# Altium schematic sheet Ind_board.SchDoc: CV060 HVAC Controller
size A3; Author: PPavlov; DrawnBy: PPavlov; Engineer: PPavlov; Organization: Celse; DocumentNumber: 1; Revision: 1; SheetNumber: 1; SheetTotal: 3
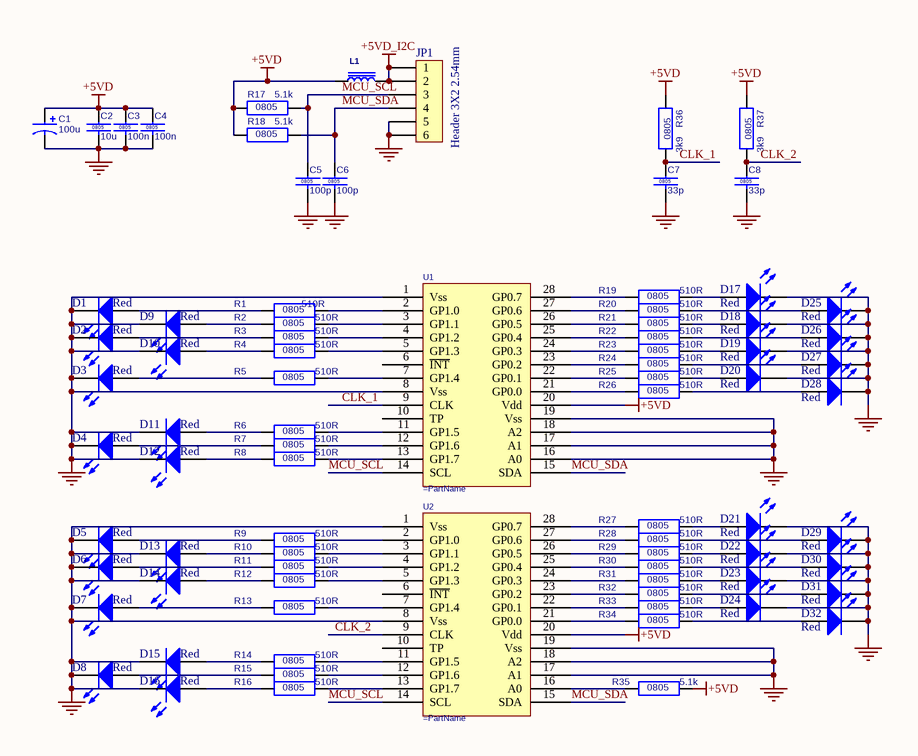
[diagram p0: Ind_board.SchDoc]

## Parts
C1  100u  [CEH12.5D10P5.0]
C2  Case: 0805  [RC0805]  (hidden comment: 10u)
C3  Case: 0805  [RC0805]  (hidden comment: 100n)
C4  Case: 0805  [RC0805]  (hidden comment: 100n)
C5  Case: 0805  [RC0805]  (hidden comment: 100p)
C6  Case: 0805  [RC0805]  (hidden comment: 100p)
C7  Case: 0805  [RC0805]  (hidden comment: 33p)
C8  Case: 0805  [RC0805]  (hidden comment: 33p)
D1  RED  [LED0805]
D2  RED  [LED0805]
D3  RED  [LED0805]
D4  RED  [LED0805]
D5  RED  [LED0805]
D6  RED  [LED0805]
D7  RED  [LED0805]
D8  RED  [LED0805]
D9  RED  [LED0805]
D10  RED  [LED0805]
D11  RED  [LED0805]
D12  RED  [LED0805]
D13  RED  [LED0805]
D14  RED  [LED0805]
D15  RED  [LED0805]
D16  RED  [LED0805]
D17  RED  [LED0805]
D18  RED  [LED0805]
D19  RED  [LED0805]
D20  RED  [LED0805]
D21  RED  [LED0805]
D22  RED  [LED0805]
D23  RED  [LED0805]
D24  RED  [LED0805]
D25  RED  [LED0805]
D26  RED  [LED0805]
D27  RED  [LED0805]
D28  RED  [LED0805]
D29  RED  [LED0805]
D30  RED  [LED0805]
D31  RED  [LED0805]
D32  RED  [LED0805]
JP1  Header 3X2 2.54mm  [Pins2x3_2.54mm]
L1  BLM31PG601SN1  [RC1206]  (value not drawn)
R1  Case: 0805  [RC0805]  (hidden comment: 510R)
R2  Case: 0805  [RC0805]  (hidden comment: 510R)
R3  Case: 0805  [RC0805]  (hidden comment: 510R)
R4  Case: 0805  [RC0805]  (hidden comment: 510R)
R5  Case: 0805  [RC0805]  (hidden comment: 510R)
R6  Case: 0805  [RC0805]  (hidden comment: 510R)
R7  Case: 0805  [RC0805]  (hidden comment: 510R)
R8  Case: 0805  [RC0805]  (hidden comment: 510R)
R9  Case: 0805  [RC0805]  (hidden comment: 510R)
R10  Case: 0805  [RC0805]  (hidden comment: 510R)
R11  Case: 0805  [RC0805]  (hidden comment: 510R)
R12  Case: 0805  [RC0805]  (hidden comment: 510R)
R13  Case: 0805  [RC0805]  (hidden comment: 510R)
R14  Case: 0805  [RC0805]  (hidden comment: 510R)
R15  Case: 0805  [RC0805]  (hidden comment: 510R)
R16  Case: 0805  [RC0805]  (hidden comment: 510R)
R17  Case: 0805  [RC0805]  (hidden comment: 5.1k)
R18  Case: 0805  [RC0805]  (hidden comment: 5.1k)
R19  Case: 0805  [RC0805]  (hidden comment: 510R)
R20  Case: 0805  [RC0805]  (hidden comment: 510R)
R21  Case: 0805  [RC0805]  (hidden comment: 510R)
R22  Case: 0805  [RC0805]  (hidden comment: 510R)
R23  Case: 0805  [RC0805]  (hidden comment: 510R)
R24  Case: 0805  [RC0805]  (hidden comment: 510R)
R25  Case: 0805  [RC0805]  (hidden comment: 510R)
R26  Case: 0805  [RC0805]  (hidden comment: 510R)
R27  Case: 0805  [RC0805]  (hidden comment: 510R)
R28  Case: 0805  [RC0805]  (hidden comment: 510R)
R29  Case: 0805  [RC0805]  (hidden comment: 510R)
R30  Case: 0805  [RC0805]  (hidden comment: 510R)
R31  Case: 0805  [RC0805]  (hidden comment: 510R)
R32  Case: 0805  [RC0805]  (hidden comment: 510R)
R33  Case: 0805  [RC0805]  (hidden comment: 510R)
R34  Case: 0805  [RC0805]  (hidden comment: 510R)
R35  Case: 0805  [RC0805]  (hidden comment: 5.1k)
R36  Case: 0805  [RC0805]  (hidden comment: 3k9)
R37  Case: 0805  [RC0805]  (hidden comment: 3k9)
U1  (no value)  [SO-28]
U2  (no value)  [SO-28]

## Nets
+5VD: C1.1 C2.1 C3.1 C4.1 L1.1 R17.1 R18.1 R35.2 R36.1 R37.1 U1.20(Vdd) U2.20(Vdd)
+5VD_I2C: JP1.1 JP1.2 L1.2
DGND: C1.2 C2.2 C3.2 C4.2 C5.2 C6.2 C7.2 C8.2 D1.1(K) D2.1(K) D3.1(K) D4.1(K) D5.1(K) D6.1(K) D7.1(K) D8.1(K) D9.1(K) D10.1(K) D11.1(K) D12.1(K) D13.1(K) D14.1(K) D15.1(K) D16.1(K) D17.1(K) D18.1(K) D19.1(K) D20.1(K) D21.1(K) D22.1(K) D23.1(K) D24.1(K) D25.1(K) D26.1(K) D27.1(K) D28.1(K) D29.1(K) D30.1(K) D31.1(K) D32.1(K) JP1.5 JP1.6 U1.1(Vss) U1.8(Vss) U1.16(A0) U1.17(A1) U1.18(A2) U1.19(Vss) U2.1(Vss) U2.8(Vss) U2.17(A1) U2.18(A2) U2.19(Vss)
CLK_1: C7.1 R36.2 U1.9(CLK)
CLK_2: C8.1 R37.2 U2.9(CLK)
MCU_SCL: C5.1 JP1.3 R17.2 U1.14(SCL) U2.14(SCL)
MCU_SDA: C6.1 JP1.4 R18.2 U1.15(SDA) U2.15(SDA)
NetD1_2: D1.2(A) R1.1
NetD2_2: D2.2(A) R3.1
NetD3_2: D3.2(A) R5.1
NetD4_2: D4.2(A) R7.1
NetD5_2: D5.2(A) R9.1
NetD6_2: D6.2(A) R11.1
NetD7_2: D7.2(A) R13.1
NetD8_2: D8.2(A) R15.1
NetD9_2: D9.2(A) R2.1
NetD10_2: D10.2(A) R4.1
NetD11_2: D11.2(A) R6.1
NetD12_2: D12.2(A) R8.1
NetD13_2: D13.2(A) R10.1
NetD14_2: D14.2(A) R12.1
NetD15_2: D15.2(A) R14.1
NetD16_2: D16.2(A) R16.1
NetD17_2: D17.2(A) R19.2
NetD18_2: D18.2(A) R21.2
NetD19_2: D19.2(A) R23.2
NetD20_2: D20.2(A) R25.2
NetD21_2: D21.2(A) R27.2
NetD22_2: D22.2(A) R29.2
NetD23_2: D23.2(A) R31.2
NetD24_2: D24.2(A) R33.2
NetD25_2: D25.2(A) R20.2
NetD26_2: D26.2(A) R22.2
NetD27_2: D27.2(A) R24.2
NetD28_2: D28.2(A) R26.2
NetD29_2: D29.2(A) R28.2
NetD30_2: D30.2(A) R30.2
NetD31_2: D31.2(A) R32.2
NetD32_2: D32.2(A) R34.2
NetR1_2: R1.2 U1.2(GP1.0)
NetR2_2: R2.2 U1.3(GP1.1)
NetR3_2: R3.2 U1.4(GP1.2)
NetR4_2: R4.2 U1.5(GP1.3)
NetR5_2: R5.2 U1.7(GP1.4)
NetR6_2: R6.2 U1.11(GP1.5)
NetR7_2: R7.2 U1.12(GP1.6)
NetR8_2: R8.2 U1.13(GP1.7)
NetR9_2: R9.2 U2.2(GP1.0)
NetR10_2: R10.2 U2.3(GP1.1)
NetR11_2: R11.2 U2.4(GP1.2)
NetR12_2: R12.2 U2.5(GP1.3)
NetR13_2: R13.2 U2.7(GP1.4)
NetR14_2: R14.2 U2.11(GP1.5)
NetR15_2: R15.2 U2.12(GP1.6)
NetR16_2: R16.2 U2.13(GP1.7)
NetR19_1: R19.1 U1.28(GP0.7)
NetR20_1: R20.1 U1.27(GP0.6)
NetR21_1: R21.1 U1.26(GP0.5)
NetR22_1: R22.1 U1.25(GP0.4)
NetR23_1: R23.1 U1.24(GP0.3)
NetR24_1: R24.1 U1.23(GP0.2)
NetR25_1: R25.1 U1.22(GP0.1)
NetR26_1: R26.1 U1.21(GP0.0)
NetR27_1: R27.1 U2.28(GP0.7)
NetR28_1: R28.1 U2.27(GP0.6)
NetR29_1: R29.1 U2.26(GP0.5)
NetR30_1: R30.1 U2.25(GP0.4)
NetR31_1: R31.1 U2.24(GP0.3)
NetR32_1: R32.1 U2.23(GP0.2)
NetR33_1: R33.1 U2.22(GP0.1)
NetR34_1: R34.1 U2.21(GP0.0)
NetR35_1: R35.1 U2.16(A0)

Not connected (* = marked no-connect by the designer): U1 6(~{INT}) 10(TP); U2 6(~{INT}) 10(TP)

## Library data of the parts
C1 = CEH12.5D10P5.0M-50V-100U: Electrolytic capacitor; Manufacturer: Panasonic; Manufacturer Part Number: EEUFC1H101; Voltage: 50V; Tolerance: 20%; Pb Free: Yes; Case: 12.5x10x5.0; Value: 100u; Part Number: CEH12.5D10P5.0M-50V-100U; Temperature: -55 - +105 C; Supplier: Megasan; MOQ: 500; Component Type: Standard; ComponentLink1Description: Manufacturer Link; ComponentLink2Description: Datasheet; ComponentLink2URL: http://industrial.panasonic.com/www-data/pdf/ABA0000/ABA0000CE22.pdf; Published: 11.12.2009; Publisher: ppavlov
C2 = CC0805K-X7R-16V0-10U0: Chip capacitor, 20p; Manufacturer: KEMET, YAGEO; Voltage: 16V; Tolerance: 10%; ROSH: Yes; Material: X7R; Package: 7" paper reel; Part number: CC0805K-X7R-16V0-10U0; Suppliers: Avnet; Temperature: -55 - +125 C; Value: 10u; Stock ID: C0800; Supplier: Avnet-Abacus; Pb Free: Yes; Component Type: Standard; ComponentLink1Description: Manufacturer Link; ComponentLink2Description: Datasheet; ComponentLink2URL: http://www.yageo.com/pdf/UPY-GPHC_X7R_6.3V-to-50V_3.pdf; Published: 11.11.2009; Publisher: tkondratyuk
C3 C4 = CC0805K-X5R-50V0-100N: Chip capacitor, 20p; Manufacturer: KEMET, YAGEO; Voltage: 50V; Tolerance: 10%; ROSH: Yes; Material: X5R; Package: 7" paper reel; Part number: CC0805K-X5R-50V0-100N; Suppliers: Avnet; Temperature: -55 - +125 C; Value: 100n; Stock ID: C045; Supplier: Avnet-Abacus; Pb Free: Yes; Component Type: Standard; ComponentLink1Description: Manufacturer Link; ComponentLink2Description: Datasheet; ComponentLink2URL: http://www.yageo.com/pdf/UPY-GPHC_X5R_6.3V-to-50V_3.pdf; Published: 05.04.2010; Publisher: ppavlov
C5 C6 = CC0805K-X5R-50V0-100P: Chip capacitor, 20p; Manufacturer: KEMET, YAGEO; Voltage: 50V; Tolerance: 10%; ROSH: Yes; Material: X5R; Package: 7" paper reel; Part number: CC0805K-X5R-50V0-100P; Suppliers: Avnet; Temperature: -55 - +125 C; Value: 100p; Stock ID: C012; Supplier: Avnet-Abacus; Pb Free: Yes; Component Type: Standard; ComponentLink1Description: Manufacturer Link; ComponentLink2Description: Datasheet; ComponentLink2URL: http://www.yageo.com/pdf/UPY-GPHC_X5R_6.3V-to-50V_3.pdf; Published: 05.04.2010; Publisher: ppavlov
C7 C8 = CC0805K-X5R-50V0-33P0: Chip capacitor, 20p; Manufacturer: KEMET, YAGEO; Voltage: 50V; Tolerance: 10%; ROSH: Yes; Material: X5R; Package: 7" paper reel; Part number: CC0805K-X5R-50V0-33P0; Suppliers: Avnet; Temperature: -55 - +125 C; Value: 33p; Stock ID: C005; Supplier: Avnet-Abacus; Pb Free: Yes; Component Type: Standard; ComponentLink1Description: Manufacturer Link; ComponentLink2Description: Datasheet; ComponentLink2URL: http://www.yageo.com/pdf/UPY-GPHC_X5R_6.3V-to-50V_3.pdf; Published: 05.04.2010; Publisher: ppavlov
D1-D32 = HSMC-C170: High Performance ChipLED / 0805; Manufacturer: Avago; Current: 20mA; Voltage: 1.9V; Color: Red; Part Number: HSMC-C170; Stock ID: D015; Temperature: -30 - +85 C; Supplier: EBV; Manufacturer Part Number: HSMC-C170; Component Type: Standard; ComponentLink1Description: Manufacturer Link; Case: LED0805; ComponentLink2Description: Datasheet; ComponentLink2URL: http://www.avagotech.com/docs/AV02-0112EN; Published: 18.11.2009; Publisher: tkondratyuk
JP1 = Header 3X2 2.54mm: Pins number: 6; Pb Free: Yes; Part Number: Header 3X2 2.54mm; Temperature: -40 - +105 C; Component Type: Standard; ComponentLink1Description: Manufacturer Link; Case: Pins2x3_2.54mm; ComponentLink2Description: Datasheet; Published: 29.06.2010; Publisher: ppavlov
L1 = BLM31PG601SN1: Ferrite bead smd; Manufacturer: Murata; ID: BLM31A260S; Tolerance: 25%; Type: Inductivity; Resistance: 600; Rated current: 1,5A; Pb Free: Yes; Package: 1206; Note: BLM31A260S; Author: PPavlov; Part Number: BLM31PG601SN1; Temperature: -55 - +125 C; Manufacturer Part Number: BLM31PG601SN1; Component Type: Standard; Case: RC1206; ComponentLink2Description: Datasheet; ComponentLink2URL: http://www.murata.com/; Published: 05.01.2010; Publisher: ppavlov
R1-R16 R19-R34 = RC0805F-510R: Chip resistor; Manufacturer: PHILIPS, SAMSUNG; Voltage: 200V; Power: 1/10W; Tolerance: 1%; Pb Free: Yes; Value: 510R; Part Number: RC0805F-510R; Temperature: -55 - +155 C; Supplier: Megasan; Component Type: Standard; ComponentLink1Description: Manufacturer Link; ComponentLink2Description: Datasheet; ComponentLink2URL: http://www.yageo.com/pdf/PYu-RC1206_51_RoHS_L_4.pdf; Published: 11.12.2009; Publisher: ppavlov
R17 R18 R35 = RC0805F-5K10: Chip resistor; Manufacturer: PHILIPS, SAMSUNG; Voltage: 200V; Power: 1/10W; Tolerance: 1%; Pb Free: Yes; Value: 5.1k; Part Number: RC0805F-5K10; Temperature: -55 - +155 C; Supplier: Megasan; Component Type: Standard; ComponentLink1Description: Manufacturer Link; ComponentLink2Description: Datasheet; ComponentLink2URL: http://www.yageo.com/pdf/PYu-RC1206_51_RoHS_L_4.pdf; Published: 11.12.2009; Publisher: ppavlov
R36 R37 = RC0805F-3K90: Chip resistor; Manufacturer: PHILIPS, SAMSUNG; Voltage: 200V; Power: 1/10W; Tolerance: 1%; Pb Free: Yes; Value: 3k9; Part Number: RC0805F-3K90; Temperature: -55 - +155 C; Supplier: Megasan; Component Type: Standard; ComponentLink1Description: Manufacturer Link; ComponentLink2Description: Datasheet; ComponentLink2URL: http://www.yageo.com/pdf/PYu-RC1206_51_RoHS_L_4.pdf; Published: 11.12.2009; Publisher: ppavlov
U1 U2 = MCP23016-I/SO: 16-Bit I2C™ I/O Expander; Manufacturer: Microchip; Pb Free: Yes; Part Number: MCP23016-I/SO; Temperature: -40 - +85 C; Manufacturer Part Number: MCP23016-I/SO; Component Type: Standard; ComponentLink1Description: Manufacturer Link; Case: SO-28; ComponentLink2Description: Datasheet; ComponentLink2URL: http://www.microchip.com/wwwproducts/Devices.aspx?dDocName=en010412; Published: 04.04.2012; Publisher: ppavlov